# EAGLE design RadioInterfaceMain (EAGLE 6.6.0)
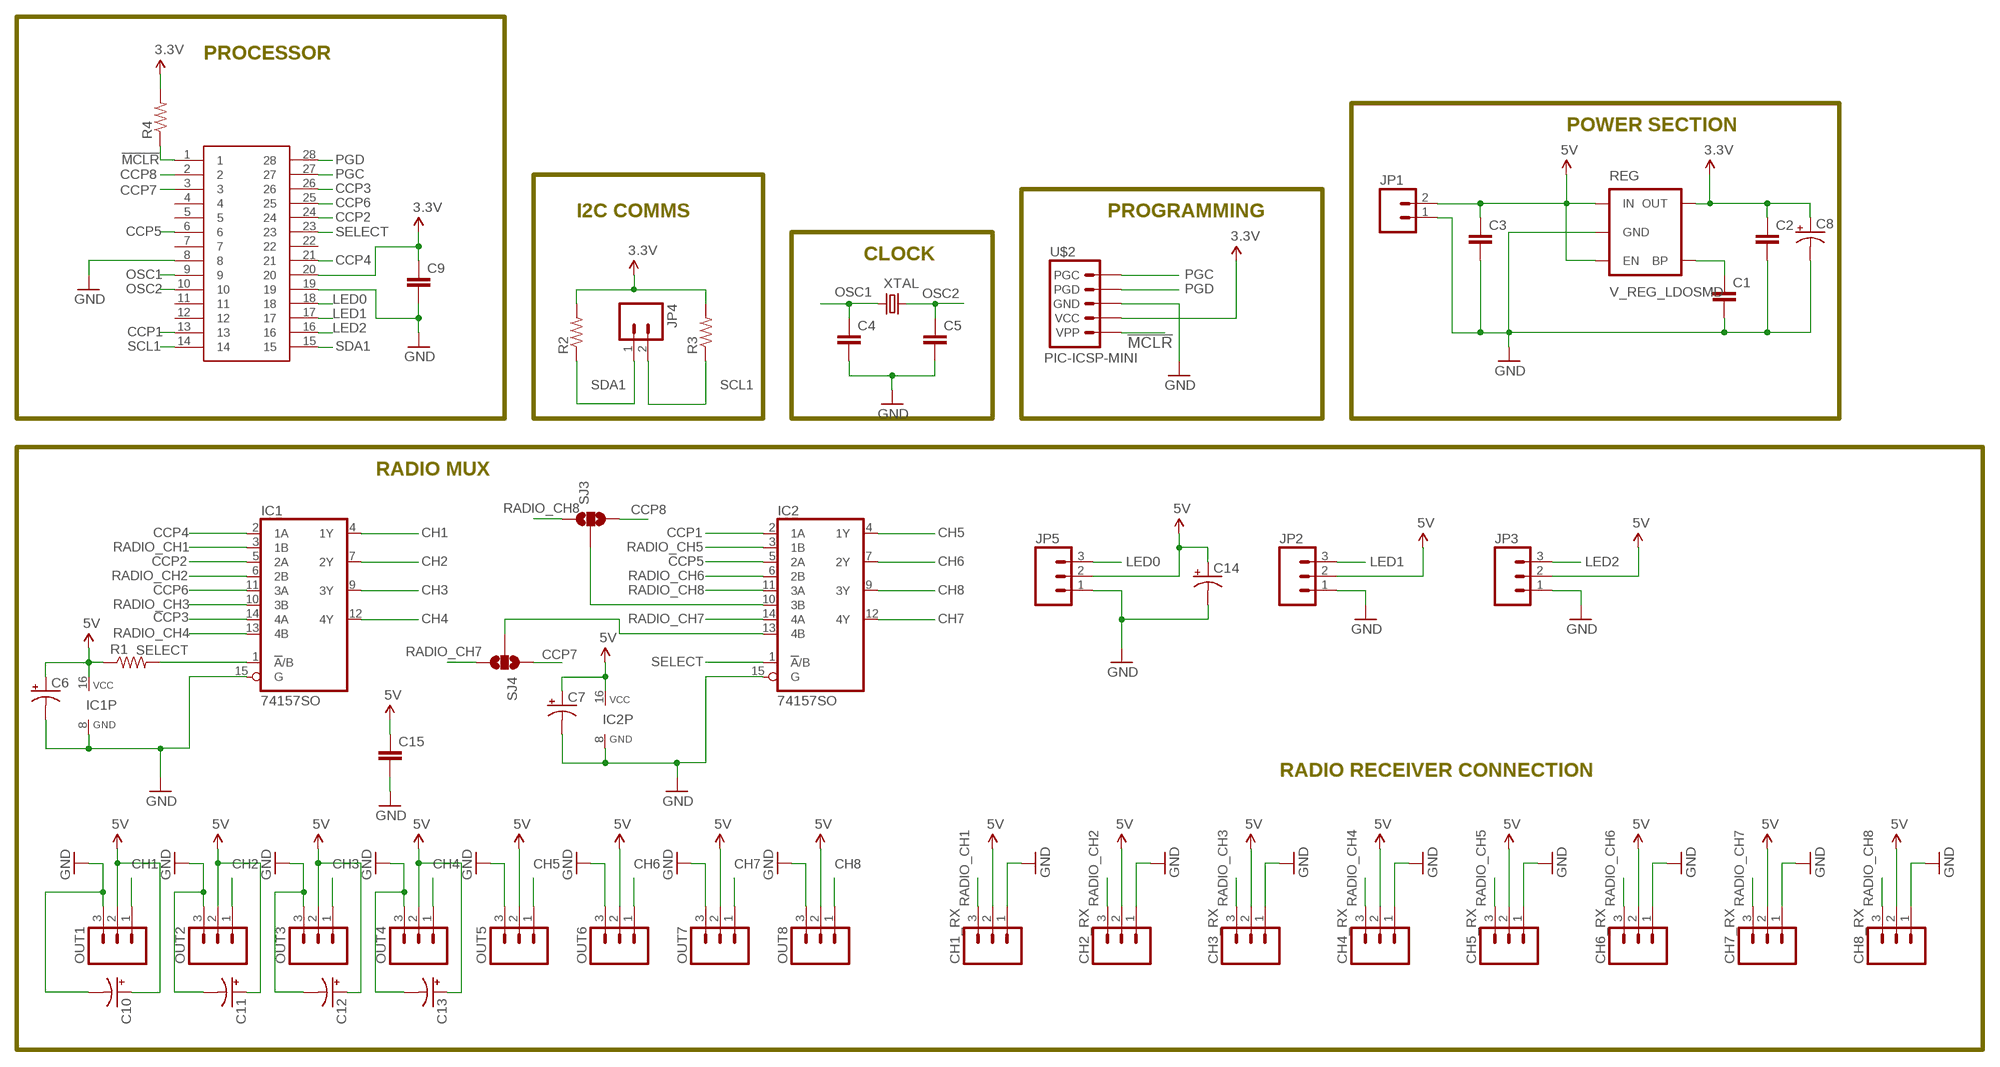
[diagram p0: schematic, sheet 1]

## Parts
C1  CAP0603-CAP  [0603-CAP]
C2  CAP1210  [1210]
C3  CAP1210  [1210]
C4  CAP0603-CAP  [0603-CAP]
C5  CAP0603-CAP  [0603-CAP]
C6  CAP_POL1206  [EIA3216]
C7  CAP_POL1206  [EIA3216]
C8  CAP_POL1206  [EIA3216]
C9  CAP0603-CAP  [0603-CAP]
C10  CAP_POL1206  [EIA3216]
C11  CAP_POL1206  [EIA3216]
C12  CAP_POL1206  [EIA3216]
C13  CAP_POL1206  [EIA3216]
C14  CAP_POL1206  [EIA3216]
C15  CAP0603-CAP  [0603-CAP]
CH1_RX  M03PTH  [1X03]
CH2_RX  M03PTH  [1X03]
CH3_RX  M03PTH  [1X03]
CH4_RX  M03PTH  [1X03]
CH5_RX  M03PTH  [1X03]
CH6_RX  M03PTH  [1X03]
CH7_RX  M03PTH  [1X03]
CH8_RX  M03PTH  [1X03]
IC1  74157SO  [SO016]
IC2  74157SO  [SO016]
JP1  M02-JST-2MM-SMT  [JST-2-SMD]
JP2  M03JST-PTH  [JST-3-PTH]
JP3  M03JST-PTH  [JST-3-PTH]
JP4  M02-JST-2MM-SMT  [JST-2-SMD]
JP5  M03JST-PTH  [JST-3-PTH]
OUT1  M03PTH  [1X03]
OUT2  M03PTH  [1X03]
OUT3  M03PTH  [1X03]
OUT4  M03PTH  [1X03]
OUT5  M03PTH  [1X03]
OUT6  M03PTH  [1X03]
OUT7  M03PTH  [1X03]
OUT8  M03PTH  [1X03]
PIC18F26K22  SSOP28  [SSOP28DB]
R1  RESISTOR0603-RES  [0603-RES]
R2  RESISTOR0603-RES  [0603-RES]
R3  RESISTOR0603-RES  [0603-RES]
R4  RESISTOR0603-RES  [0603-RES]
REG  V_REG_LDOSMD  [SOT23-5]
SJ3  SOLDERJUMPER_2WAY-OLDS  [SJ_3]
SJ4  SOLDERJUMPER_2WAY-OLDS  [SJ_3]
U$2  PIC-ICSP-MINI  [PIC-ICSP-MINI]
XTAL  CRYSTAL5X3  [CRYSTAL-SMD-5X3]

## Nets
3.3V: C2.1 C8.A(+) C9.1 PIC18F26K22.20 R2.2 R3.2 R4.2 REG.5(OUT) U$2.2(VCC)
5V: C3.1 C6.A(+) C7.A(+) C10.A(+) C11.A(+) C12.A(+) C13.A(+) C14.A(+) C15.1 CH1_RX.2 CH2_RX.2 CH3_RX.2 CH4_RX.2 CH5_RX.2 CH6_RX.2 CH7_RX.2 CH8_RX.2 IC1.16(VCC) IC2.16(VCC) JP1.2 JP2.2 JP3.2 JP5.2 OUT1.2 OUT2.2 OUT3.2 OUT4.2 OUT5.2 OUT6.2 OUT7.2 OUT8.2 R1.1 REG.1(IN) REG.3(EN)
!MCLR: PIC18F26K22.1 R4.1 U$2.1(VPP)
CCP1: IC2.2(1A) PIC18F26K22.13
CCP2: IC1.5(2A) PIC18F26K22.24
CCP3: IC1.14(4A) PIC18F26K22.26
CCP4: IC1.2(1A) PIC18F26K22.21
CCP5: IC2.5(2A) PIC18F26K22.6
CCP6: IC1.11(3A) PIC18F26K22.25
CCP7: PIC18F26K22.3 SJ4.1
CCP8: PIC18F26K22.2 SJ3.3
CH1: IC1.4(1Y) OUT1.1
CH2: IC1.7(2Y) OUT2.1
CH3: IC1.9(3Y) OUT3.1
CH4: IC1.12(4Y) OUT4.1
CH5: IC2.4(1Y) OUT5.1
CH6: IC2.7(2Y) OUT6.1
CH7: IC2.12(4Y) OUT7.1
CH8: IC2.9(3Y) OUT8.1
GND: C1.2 C2.2 C3.2 C4.2 C5.2 C6.C(-) C7.C(-) C8.C(-) C9.2 C10.C(-) C11.C(-) C12.C(-) C13.C(-) C14.C(-) C15.2 CH1_RX.1 CH2_RX.1 CH3_RX.1 CH4_RX.1 CH5_RX.1 CH6_RX.1 CH7_RX.1 CH8_RX.1 IC1.8(GND) IC1.15(G) IC2.8(GND) IC2.15(G) JP1.1 JP2.1 JP3.1 JP5.1 OUT1.3 OUT2.3 OUT3.3 OUT4.3 OUT5.3 OUT6.3 OUT7.3 OUT8.3 PIC18F26K22.8 PIC18F26K22.19 REG.2(GND) U$2.3(GND)
LED0: JP5.3 PIC18F26K22.18
LED1: JP2.3 PIC18F26K22.17
LED2: JP3.3 PIC18F26K22.16
N$1: IC2.10(3B) SJ3.2
N$2: C1.1 REG.4(BP)
N$3: IC2.13(4B) SJ4.2
OSC1: C4.1 PIC18F26K22.9 XTAL.1
OSC2: C5.1 PIC18F26K22.10 XTAL.3
PGC: PIC18F26K22.27 U$2.5(PGC)
PGD: PIC18F26K22.28 U$2.4(PGD)
RADIO_CH1: CH1_RX.3 IC1.3(1B)
RADIO_CH2: CH2_RX.3 IC1.6(2B)
RADIO_CH3: CH3_RX.3 IC1.10(3B)
RADIO_CH4: CH4_RX.3 IC1.13(4B)
RADIO_CH5: CH5_RX.3 IC2.3(1B)
RADIO_CH6: CH6_RX.3 IC2.6(2B)
RADIO_CH7: CH7_RX.3 IC2.14(4A) SJ4.3
RADIO_CH8: CH8_RX.3 IC2.11(3A) SJ3.1
SCL1: JP4.2 PIC18F26K22.14 R3.1
SDA1: JP4.1 PIC18F26K22.15 R2.1
SELECT: IC1.1(!A!/B) IC2.1(!A!/B) PIC18F26K22.23 R1.2
Unconnected: PIC18F26K22.4 PIC18F26K22.5 PIC18F26K22.7 PIC18F26K22.11 PIC18F26K22.12 PIC18F26K22.22

## Notes on the sheet
- PROCESSOR
- POWER SECTION
- I2C COMMS | PROGRAMMING
- CLOCK
- RADIO MUX
- RADIO RECEIVER CONNECTION

## Library data of the parts
C1-C5 C9 C15 = SparkFun:CAP: Capacitor Standard 0603 ceramic capacitor, and 0.1" leaded capacitor.
C6-C8 C10-C14 = SparkFun:CAP_POL: Capacitor Polarized These are standard SMD and PTH capacitors. Normally 10uF, 47uF, and 100uF in electrolytic and tantalum varieties. Always verify the external diameter of the through hole cap, it varies with capacity, voltage, and manufacturer. The EIA devices should be standard.
CH1_RX CH2_RX CH3_RX CH4_RX CH5_RX CH6_RX CH7_RX CH8_RX JP2 JP3 JP5 OUT1-OUT8 = SparkFun:M03: Header 3 Standard 3-pin 0.1" header. Use with straight break away headers (SKU : PRT-00116), right angle break away headers (PRT-00553), swiss pins (PRT-00743), machine pins (PRT-00117), and female headers (PRT-00115). Molex polarized connector foot print use with SKU : PRT-08232 with associated crimp pins and housings.
IC1 IC2 = SparkFun:74*157: Quadruple 2-line to 1-line data SELECTOR/MULTIPLEXER
JP1 JP4 = SparkFun:M02: Header 2 Standard 2-pin 0.1" header. Use with straight break away headers (SKU : PRT-00116), right angle break away headers (PRT-00553), swiss pins (PRT-00743), machine pins (PRT-00117), and female headers (PRT-00115). Molex polarized connector foot print use with SKU : PRT-08233 with associated crimp pins and housings.
PIC18F26K22 = SparkFun:SSOP28
R1-R4 = SparkFun:RESISTOR: Resistor Basic schematic elements and footprints for 0603, 1206, and PTH resistors.
REG = SparkFun:V_REG_LDO: Voltage Regulator LDO Standard 150mA LDO voltage regulator in SOT-23 layout. Micrel part MIC5205. BP (by-pass) pin is used to lower output noise with 470pF cap.
SJ3 SJ4 = SparkFun:SOLDERJUMPER_2WAY-OLD: Solder Jumper 2 way solder jumper
U$2 = SparkFun:PIC-ICSP-MINI: PIC-ICSP-Mini Miniature 5-pin connection for temporary programming of PICs. Use this device in your design to save space. Program the PIC with this adapter Spark Fun Electronics SKU : BOB-00194
XTAL = SparkFun:CRYSTAL: Crystals Various standard crystals. Proven footprints. Spark Fun Electronics SKU : COM-00534

## Board
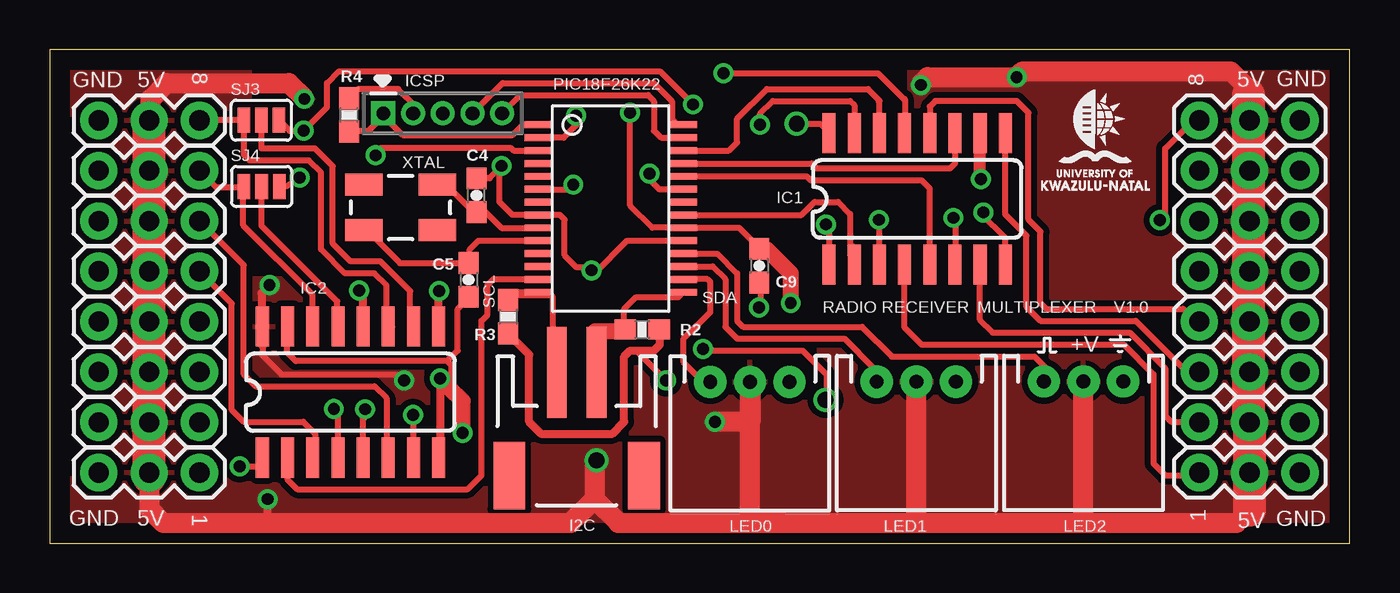
[diagram p1: board, top side]
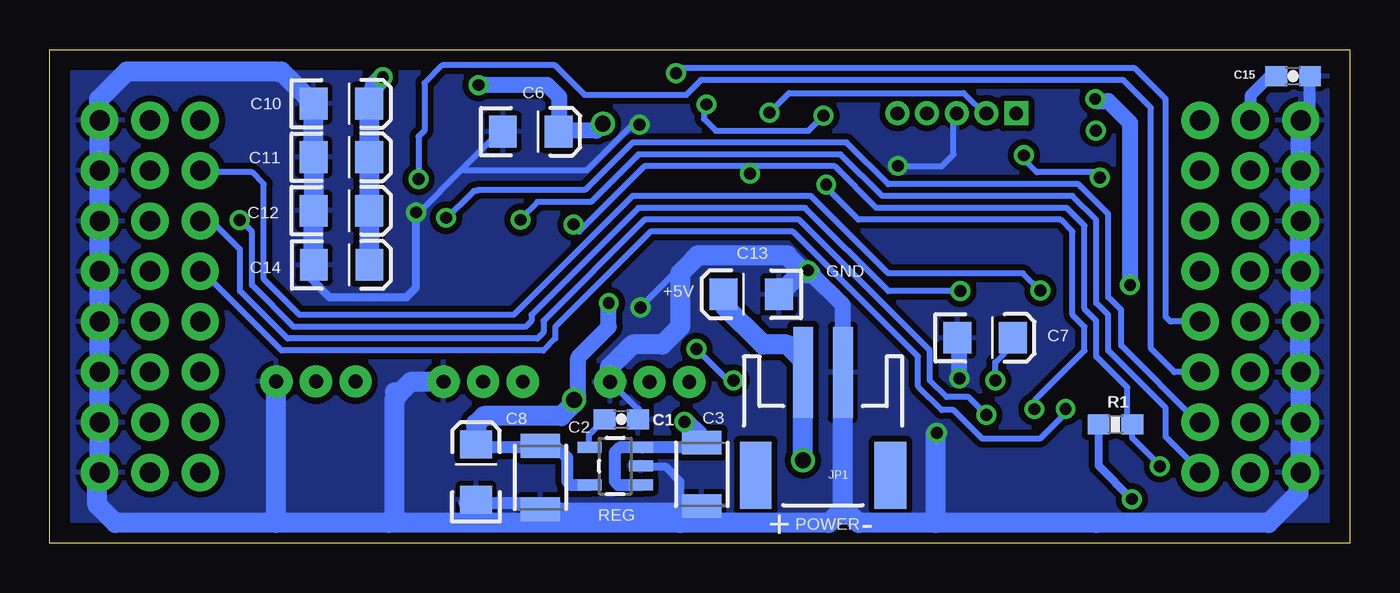
[diagram p2: board, bottom side, seen from below]

Size 65.61 x 24.93 mm. Coordinates in mm from the lower left corner, seen from the top.
Outline: 0,0 65.61,0 65.61,24.93 0,24.93 0,0
Copper layers (1*16): Top 0.035mm / dielectric 1.5mm / Bottom 0.035mm
Design rules "default": minimum track width 10mil, minimum drill 24mil, track to track 8mil, track to pad 8mil, pad to pad 8mil, via to via 8mil, smd to smd 8mil, copper to edge 40mil, drill to drill 8mil, minimum pad ring 10mil, minimum via ring 8mil, stop-mask expansion 4mil, vias tented up to drill 0mil, thermal gap 10mil

### Footprints (pad centres in the part's own frame; a part is rotated, then mirrored left to right if it is on the bottom)
0603-CAP = smd 1.1 x 1: 1 -0.85,0; 2 0.85,0
1210 = smd 1.2 x 2: 1 -1.6,0; 2 1.6,0
EIA3216 = smd 1.4 x 1.6: A 1.4,0; C -1.4,0
1X03 = drill 1.016 pad 1.88 round: 1 0,0; 2 2.54,0; 3 5.08,0
SO016 = smd 0.66 x 2.032: 1 -4.445,-3.315; 2 -3.175,-3.315; 3 -1.905,-3.315; 4 -0.635,-3.315; 5 0.635,-3.315; 6 1.905,-3.315; 7 3.175,-3.315; 8 4.445,-3.315; 9 4.445,3.315; 10 3.175,3.315; 11 1.905,3.315; 12 0.635,3.315; 13 -0.635,3.315; 14 -1.905,3.315; 15 -3.175,3.315; 16 -4.445,3.315
JST-2-SMD = smd 1 x 4.6: 1 -1,-3.7; 2 1,-3.7 | smd 1.6 x 3.4: NC1 -3.4,1.5; NC2 3.4,1.5
JST-3-PTH = drill 0.7 pad 1.626 round: 1 -2,-5; 2 0,-5; 3 2,-5
SSOP28DB = smd 0.348 x 1.397: 1 -4.225,-3.656; 2 -3.575,-3.656; 3 -2.925,-3.656; 4 -2.275,-3.656; 5 -1.625,-3.656; 6 -0.975,-3.656; 7 -0.325,-3.656; 8 0.325,-3.656; 9 0.975,-3.656; 10 1.625,-3.656; 11 2.275,-3.656; 12 2.925,-3.656; 13 3.575,-3.656; 14 4.225,-3.656; 15 4.225,3.656; 16 3.575,3.656; 17 2.925,3.656; 18 2.275,3.656; 19 1.625,3.656; 20 0.975,3.656; 21 0.325,3.656; 22 -0.325,3.656; 23 -0.975,3.656; 24 -1.625,3.656; 25 -2.275,3.656; 26 -2.925,3.656; 27 -3.575,3.656; 28 -4.225,3.656
0603-RES = smd 1.1 x 1: 1 -0.85,0; 2 0.85,0
SOT23-5 = smd 0.55 x 1.2: 1 -0.95,-1.3; 2 0,-1.3; 3 0.95,-1.3; 4 0.95,1.3; 5 -0.95,1.3
SJ_3 = smd 0.635 x 1.27: 1 -0.889,0; 2 0,0; 3 0.889,0
PIC-ICSP-MINI = drill 0.7 square: 1 -3,0 | drill 0.7 round: 2 -1.5,0; 3 0,0; 4 1.5,0; 5 3,0
CRYSTAL-SMD-5X3 = smd 1.9 x 1.1: 1 -1.85,-1.15; 2 1.85,-1.15; 3 1.85,1.15; 4 -1.85,1.15

### Placement (x,y rotation side)
C1  36.77,6.26 0 bottom
C2  40.84,3.33 270 bottom
C3  32.7,3.48 270 bottom
C4  21.54,17.57 90 top
C5  21.14,13.3 270 top
C6  41.34,20.78 0 bottom
C7  18.41,10.38 0 bottom
C8  44.09,3.6 90 bottom
C9  35.8,14.02 270 top
C10  50.88,22.2 0 bottom
C11  50.88,19.5 0 bottom
C12  50.88,16.8 0 bottom
C13  30.21,12.58 180 bottom
C14  50.88,14.06 0 bottom
C15  2.87,23.59 0 bottom
CH1_RX  2.48,3.58 0 top
CH2_RX  2.48,6.12 0 top
CH3_RX  2.48,8.66 0 top
CH4_RX  2.48,11.2 0 top
CH5_RX  2.48,13.74 0 top
CH6_RX  2.48,16.28 0 top
CH7_RX  2.48,18.82 0 top
CH8_RX  2.48,21.36 0 top
IC1  43.77,17.39 0 top
IC2  15.18,7.64 0 top
JP1  26.58,4.93 180 bottom
JP2  43.73,3.17 180 top
JP3  35.34,3.15 180 top
JP4  26.59,4.93 180 top
JP5  52.17,3.17 180 top
OUT1  58,3.58 0 top
OUT2  58,6.12 0 top
OUT3  58,8.66 0 top
OUT4  58,11.2 0 top
OUT5  58,13.74 0 top
OUT6  58,16.28 0 top
OUT7  58,18.82 0 top
OUT8  58,21.36 0 top
PIC18F26K22  28.32,16.91 270 top
R1  11.83,6.01 0 bottom
R2  29.9,10.8 0 top
R3  23.14,11.44 270 top
R4  15.11,21.63 90 top
REG  37.06,3.91 90 bottom
SJ3  10.69,21.37 0 top
SJ4  10.7,18.02 180 top
U$2  19.84,21.71 0 top
XTAL  17.72,16.96 180 top

### Tracks (layer width: path | path; a pad name or v marks a point on that pad's centre or on a via)
3.3V  (via drill 0.6, 0.8)
  Top 0.305: 18.5,21.73 18.5,21.71 U$2.2 18.37,21.73 18.5,21.73 | R4.2 15.57,22.94 17.6,22.94 18.5,22.04 18.5,21.73 | v29.3,21.73 29.3,17.06 30.42,15.94 31.89,15.94 31.92,15.91 31.93,15.93 PIC18F26K22.20 34.8,15.93 35.89,14.84 35.86,14.87 C9.1 35.77,14.84 | v32.97,9.81 33.05,9.74 37.99,9.74 39.2,8.54 39.2,7.29 v39.14,7.24 | v31.1,8.24 29.6,9.74 29.3,9.74
  Top 0.406: R2.2 30.8,10.75 30.8,10.04 30.5,9.74 29.3,9.74 29,9.44 29,6.13 28.39,5.54 24.8,5.54 24.2,6.13 24.2,9.54 R3.2
  Top 0.813: v37.39,12.14 37.39,13.64 36.2,14.84 35.89,14.84 35.84,14.84 C9.1
  Bottom 0.305: U$2.2 18.34,21.58 19.5,22.73 28.3,22.73 v29.3,21.73 | v32.97,9.81 31.39,8.24 v31.1,8.24
  Bottom 0.61: C8.A 44.59,4.9 44.59,4.88 41.48,4.88 C2.1 40.98,4.92 40.99,4.93 40.09,4.93 39.49,4.33 39.49,3.13 39.31,2.96 REG.5 | 39.09,7.24 v39.14,7.24 38.95,7.43
  Bottom 0.813: 38.95,7.43 38.95,9.39 37.39,10.94 v37.39,12.14
  Bottom 1.016: C8.A 44.09,6.04 43.7,6.43 39.79,6.43 39.14,7.08 v39.14,7.24
5V  (via drill 0.6, 0.8)
  Top 0.305: IC1.16 39.33,20.72 39.34,20.73 38.89,21.19 v37.7,21.19 | 10.74,9.99 10.74,9.49 11.71,8.52 17.69,8.52 17.69,8.44 v17.89,8.24
  Top 0.406: 10.74,9.99 IC2.16 10.69,10.45 10.69,12.64 11.14,13.09 v11.09,13.03 | 10.99,1.03 v10.99,2.23
  Top 0.61: 5.09,21.39 5.05,21.39 CH8_RX.2
  Top 1.016: CH1_RX.2 5.03,3.25 5.04,3.23 5.04,1.73 5.75,1.03 10.99,1.03 26.3,1.03 27.5,2.23 | 5.09,21.39 5.09,22.44 5.9,23.23 12.07,23.23 v12.86,22.44 v12.85,22.44 | v27.6,4.2 27.57,4.23 27.52,4.23 27.52,2.26 27.5,2.23 | 60.54,1.69 59.89,1.03 52.09,1.03 | 35.29,1.03 28.7,1.03 27.5,2.23 | 37.09,1.03 43.99,1.03 | 43.99,1.03 52.09,1.03 | 35.34,1.07 JP3.2 | 35.29,1.03 35.34,1.07 | JP2.2 43.73,1.29 43.99,1.03 | 52.09,1.03 52.09,1.33 52.17,1.41 JP5.2 | v43.97,23.14 43.97,23.21 44.29,23.54 v48.79,23.54 49.09,23.84 59.59,23.84 60.54,22.89 | 35.34,1.07 35.38,1.03 37.09,1.03 | 35.29,1.03 37.09,1.03 | 35.29,1.03 35.34,1.08 35.34,8.12 35.37,8.09 35.37,6.18 35.32,6.13 v33.57,6.13
  Top 1.676: 5.07,18.82 5.15,18.73 | 5.07,18.82 CH7_RX.2 CH6_RX.2 | CH8_RX.2 5.03,18.86 5.07,18.82 | CH6_RX.2 5.03,16.26 5.04,16.23 | CH5_RX.2 5.03,13.56 5.04,13.54 | CH5_RX.2 CH6_RX.2 | 5,11.2 4.95,11.14 | 5,11.2 CH4_RX.2 5.03,8.82 4.95,8.74 CH3_RX.2 CH2_RX.2 | CH5_RX.2 5.03,11.22 5,11.2 | CH2_RX.2 5.03,6.01 4.95,5.93 | CH2_RX.2 CH1_RX.2 5.03,3.35 5.04,3.33 | 60.54,1.69 60.54,6.08 60.49,6.13 60.49,22.64
  Bottom 0.305: v37.7,21.19 38.1,20.78 | C7.A 17.01,10.05 17,10.04 17.89,9.14 v17.89,8.24 | JP1.2 27.5,8.54 | JP1.2 | 27.8,9.44 27.8,8.84 JP1.2
  Bottom 0.406: 12.82,22.46 v12.85,22.44 | R1.1 12.68,3.92 v10.99,2.23
  Bottom 0.61: C3.1 32.54,5.08 32.45,4.99 32.57,4.85 REG.3 35.71,4.85 35.7,4.83 36.84,4.83 37.09,4.58 37.09,3.13 36.91,2.96 REG.1 | C15.1 4.04,23.59 5,22.64 5,21.44 5.03,21.41 CH8_RX.2
  Bottom 0.813: 39.88,20.83 C6.A | 39.88,20.83 39.88,22.53 40.49,23.14 v43.97,23.14 | v37.7,21.19 37.7,21.16 38.03,20.83 39.88,20.83 | v11.09,13.03 11.09,21.23 12.19,22.34 12.79,22.34 12.85,22.39 v12.85,22.44
  Bottom 1.016: C13.A 31.61,12.05 29.6,10.04 28.39,10.04 27.8,9.44 27.6,9.24 v27.6,4.2 | v48.79,23.54 49.18,23.14 C10.A 49.48,19.73 49.39,19.64 49.48,19.55 C11.A C12.A | C12.A 49.48,16.73 49.39,16.64 | 49.48,14.02 49.39,13.94 | 49.48,14.02 C14.A | C12.A 49.48,14.03 49.48,14.02 | C3.1 32.79,5.17 32.83,5.17 32.83,5.4 v33.57,6.13
  pour Top (isolate 0.305): -0.1,24.44 -0.1,0.43 64.7,0.43 64.7,24.44 43.39,24.44 43.39,13.34 10.09,13.34 10.09,24.44
!MCLR
  Top 0.305: U$2.1 16.84,21.28 | 16.7,21.44 16.82,21.55 U$2.1 | R4.1 15.17,20.84 16.09,20.84 16.7,21.44 | U$2.1 16.81,21.73 16.7,21.73 16.7,21.44 | PIC18F26K22.1 23.89,21.13 23.37,20.61 17.82,20.61 16.84,21.59 U$2.1
CCP1
  Top 0.305: 11.99,3.83 12.01,3.82 IC2.2 12.01,4.3 11.99,4.29 11.99,3.23 12.49,2.73 21.1,2.73 21.8,3.44 21.8,11.24 22.1,11.54 22.1,13.04 22.39,13.34 24.5,13.34 24.5,13.33 PIC18F26K22.13
CCP2
  Top 0.305: 44.39,14.44 44.39,15.04 | 44.39,14.44 IC1.5 | 44.39,14.44 44.39,17.94 43.99,18.34 38.39,18.34 38.2,18.53 PIC18F26K22.24
CCP3
  Top 0.305: 41.89,20.54 41.99,20.64 41.92,20.71 IC1.14 41.87,20.76 41.89,20.79 41.84,20.84 41.84,22.29 41.89,22.34 41.29,22.94 36.2,22.94 34.7,21.44 34.7,20.23 34.29,19.83 PIC18F26K22.26
CCP4
  Top 0.305: IC1.2 40.49,14.19 40.49,15.04 | IC1.2 40.6,14.18 40.49,14.29 | PIC18F26K22.21 37.94,16.58 38.59,17.23 39.79,17.23 40.39,16.64 40.39,14.54 40.7,14.24 40.6,14.14 IC1.2
CCP5  (via drill 0.6)
  Top 0.305: 15.82,3.71 15.74,3.63 15.79,3.58 | IC2.5 15.82,3.71 | 16.02,6.48 16.08,6.53 | 16.02,6.48 v15.92,6.78 | 15.82,3.71 15.82,6.28 16.02,6.48 | PIC18F26K22.6 24.7,17.84 26.3,17.84 | 26.3,17.84 26.43,17.96 v26.43,18.12 | 26.3,17.84 26.6,17.84
  Bottom 0.305: v15.92,6.78 15.92,6.56 15.89,6.54 15.89,7.24 13.39,9.74 13.39,10.94 13.99,11.54 13.99,15.74 14.59,16.34 24.8,16.34 26.3,17.84 26.25,17.88 v26.43,18.12
CCP6
  Top 0.305: 45.77,20.71 45.79,20.73 | 45.77,20.71 IC1.11 45.68,20.5 45.7,20.48 45.7,19.19 45.45,18.94 38.7,18.94 38.45,19.18 PIC18F26K22.25 | 45.77,20.71 45.7,20.64
CCP7  (via drill 0.6)
  Top 0.305: SJ4.1 11.91,18.02 v12.62,18.47 | 16.39,19.64 16.44,19.59 v16.46,19.59 16.73,19.86 16.73,19.98 23.25,19.98 23.4,19.83 PIC18F26K22.3
  Bottom 0.305: v12.62,18.47 12.34,18.47 12.6,18.73 15.79,18.73 16.7,19.64 16.5,19.64 v16.46,19.59
CCP8  (via drill 0.6)
  Top 0.305: SJ3.3 12.11,20.84 v12.81,20.84 v12.82,20.84 13.99,22.02 13.99,23.23 14.59,23.84 30.8,23.84 32.59,22.04 v32.47,22.16 | v26.55,21.6 26.55,21.18 26.6,21.14 25.94,20.48 PIC18F26K22.2
  Bottom 0.305: v26.55,21.6 27.32,20.84 32,20.84 32.59,21.44 32.59,22.04 v32.47,22.16
CH1
  Top 0.305: IC1.4 43.14,10.89 43.99,10.04 54.2,10.04 55.7,8.54 55.7,4.04 56.29,3.44 58.09,3.44 58,3.52 OUT1.1
CH2
  Top 0.305: 57.89,6.04 57.99,6.13 OUT2.1 58.07,6.12 58.09,6.13 56.59,6.13 56.29,6.43 56.29,8.84 54.49,10.64 47.59,10.64 46.95,11.28 IC1.7
CH3
  Top 0.305: IC1.9 48.22,16.61 49.29,15.54 49.29,11.94 49.99,11.24 54.79,11.24 57.49,8.54 57.79,8.54 57.91,8.66 OUT3.1 | OUT3.1 58.09,8.74 | OUT3.1 | OUT3.1
CH4
  Top 0.305: IC1.12 44.41,22.05 44.69,22.33 48.8,22.33 49.39,21.73 49.39,16.34 49.99,15.74 49.99,12.14 50.29,11.84 57.2,11.84 57.84,11.2 OUT4.1 | 57.89,11.24 57.93,11.2 OUT4.1 | 57.99,11.14 58,11.15 OUT4.1
CH5  (via drill 0.6)
  Top 0.305: IC2.4 14.55,6.48 v14.34,6.79
  Bottom 0.305: v14.34,6.79 14.44,6.49 15.64,5.29 18.55,5.29 20,6.74 20.6,6.74 21.8,7.93 21.8,9.44 28.1,15.74 35.29,15.74 40.09,10.94 40.09,10.34 40.7,9.74 53.89,9.74 57.89,13.74 OUT5.1
CH6  (via drill 0.6)
  Top 0.305: v18.35,6.49 18.35,6.54 18.36,6.52 IC2.7
  Bottom 0.305: 58,16.3 58.04,16.34 | 58,16.3 OUT6.1 57.85,16.28 57.79,16.34 57.49,16.34 55.99,14.84 55.99,12.74 53.59,10.34 40.99,10.34 40.7,10.64 40.7,11.24 35.59,16.34 27.8,16.34 21.2,9.74 21.2,8.24 20.35,7.38 19.25,7.38 v18.35,6.49 18.3,6.43 | 58,16.3 OUT6.1
CH7  (via drill 0.6)
  Top 0.305: v15.62,12.76 15.84,12.64 15.82,12.61
  Top 0.406: IC2.12 15.82,11.36 15.79,11.39 15.82,11.41 15.82,12.61
  Bottom 0.305: 15.79,12.64 v15.62,12.76 16.5,13.64 23.3,13.64 27.2,17.54 36.2,17.54 42.2,11.54 52.99,11.54 54.79,13.34 54.79,18.14 55.39,18.73 58.09,18.73 OUT7.1 | 58,18.86 58.03,18.88 | OUT7.1 58,18.86 | 58,18.86 57.98,18.83 | 57.99,18.84 OUT7.1
CH8  (via drill 0.6)
  Top 0.305: 19.63,12.72 v19.64,12.74 | OUT8.1 58.04,21.36 58.05,21.34 57.7,21.34 56.29,19.94 56.29,16.64 55.99,16.34 56,16.33 v56.02,16.33
  Top 0.406: IC2.9 19.6,10.99 19.63,11.02 19.63,12.72
  Bottom 0.305: 19.6,12.74 v19.64,12.74 23.3,12.74 27.5,16.94 35.89,16.94 41.29,11.54 41.29,11.24 41.59,10.94 53.29,10.94 55.39,13.04 55.39,15.74 55.99,16.34 56,16.33 v56.02,16.33
GND  (via drill 0.6)
  Top 0.305: 48.24,14.06 IC1.8 48.22,14.21 48.2,14.24 48.2,15.44 46.99,16.64 47.07,16.71 v47.12,16.71 | 21.5,18.44 21.51,18.43 C4.2 21.53,18.44 21.5,18.44 | 21.5,18.44 22.1,18.44 | 21.5,18.44 22.21,18.44 v22.81,19.06 22.72,19.06 22.7,19.04 22.7,17.23 23.35,16.58 PIC18F26K22.8 25.75,16.58 26,16.34 26,14.54 26.6,13.94 27.2,13.94 | 11.99,10.39 11.99,9.64 12.42,9.21 20.07,9.21 | C5.2 21.16,12.44 21.2,12.44 20.6,11.84 20.6,9.74 20.07,9.21 | 20.19,7.83 20.3,7.93 20.3,8.98 20.07,9.21 | 27.2,13.94 27.15,13.98 | 27.2,13.94 v27.35,13.79 27.5,13.64 29.14,15.28 PIC18F26K22.19 | v35.8,11.91 35.87,11.84 35.89,11.84 35.89,13.08 C9.2 | v35.84,21.14 35.84,21.69 36.49,22.34 40.39,22.34 40.6,22.13 IC1.15
  Top 0.406: 11.99,10.39 IC2.15 | 19.7,4.26 19.7,4.04 | 19.7,4.26 IC2.8 | v19.7,8.33 19.7,4.26
  Top 0.61: IC2.8 19.64,3.79
  Top 0.813: v19.7,8.33 20.19,7.83 20.84,7.19 v20.84,5.58 v20.84,5.59
  Bottom 0.305: C6.C 42.9,20.78 44.77,18.91 | v47.12,16.71 47.04,16.64 44.77,18.91 | C8.C 44.66,2.2 44.59,2.13 44.64,2.08 | 44.77,18.91 44.7,18.84 38.49,18.84 36.2,21.14 v35.84,21.14 | U$2.3 20,21.55 20,19.64 20.6,19.04 23,19.04 23,19.05 v22.81,19.06 | 37.34,8.18 37.39,8.24 | JP3.1 37.34,8.18 | 37.34,8.18 35.91,6.75 | 33.04,14.39 33.2,14.54 35.8,11.93 v35.8,11.91 | REG.2 35.75,3.9 34.56,3.9 33.82,3.16 33.82,1.08 33.79,1.05 33.79,1.03
  Bottom 0.406: C3.2 33.09,1.88 | REG.2 35.74,3.93 35.7,3.88 34.54,3.88 33.79,3.13 33.79,1.73 33.79,1.64 | 12.79,1.03 12.68,1.15 | JP3.1 37.31,8.16 | 35.91,6.75 C1.2 | v47.12,16.71 47.12,12.91 47.59,12.44 51.49,12.44 52.39,13.34 52.39,13.94 C14.C
  Bottom 0.61: C8.C 44.7,2.04 41.75,2.04 C2.2 41.43,1.73 33.79,1.73 32.79,1.73 32.79,1.79 C3.2 | 2.48,21.25 2.6,21.14 | CH8_RX.1 2.48,21.25 | C15.2 2.02,21.71 2.48,21.25
  Bottom 0.813: C7.C 19.7,10.27 v19.7,8.33 | v20.84,5.59 v20.84,5.58 | 20.89,1.23 20.84,1.29 | JP1.1 25.59,12.03 27.2,13.64
  Bottom 1.016: 25.59,1.82 JP1.1 | 20.89,1.03 12.79,1.03 4.09,1.03 2.6,2.54 2.6,3.73 | 2.6,3.73 2.48,3.62 CH1_RX.1 | 20.84,1.29 20.89,1.34 | 20.89,1.03 20.89,1.23 20.89,5.45 20.84,5.5 20.88,5.54 20.89,5.54 v20.84,5.59 | C13.C 27.75,13.64 27.5,13.64 | 27.5,13.64 27.2,13.64 v27.35,13.79 27.5,13.64 | 20.89,1.03 24.8,1.03 25.59,1.82 | 25.59,1.82 25.59,1.74 26.3,1.03 33.79,1.03 48.49,1.03 | 48.49,1.03 54.2,1.03 | 54.2,1.03 62.29,1.03 63.2,1.94 63.2,3.46 OUT1.3 63.09,5.95 62.91,6.12 | JP2.1 47.36,8.17 48.04,7.49 | 48.04,7.49 48.2,7.33 48.2,1.33 48.49,1.03 | JP5.1 54.17,1.06 54.2,1.03 | 48.04,7.49 48.2,7.63 | JP3.1 37.34,8.9 36.2,10.04 34.7,10.04 33.79,10.94 33.79,13.64 33.04,14.39 32.89,14.54 28.39,14.54 27.5,13.64 | 62.91,6.12 62.89,6.13 | 62.91,6.12 OUT2.3 63.09,8.43 63.2,8.54 OUT3.3 63.09,11.12 63.15,11.2 | 63.15,11.2 63.2,11.24 | 63.15,11.2 OUT4.3 63.09,13.53 63.2,13.64 OUT5.3 63.09,16.23 63.13,16.28 | 63.13,16.28 63.2,16.34 | 63.13,16.28 OUT6.3 63.09,18.62 63.2,18.73 63.11,18.82 OUT7.3 63.09,20.82 | OUT8.3 63.09,21.25 63.2,21.14 63.09,21.03 63.09,20.82 | 63.09,20.82 63.11,20.82 63.11,22.42 61.7,23.84 54.2,23.84 54.17,23.81 53.9,23.81 C10.C 52.31,22.17 52.31,19.67 52.29,19.65 C11.C | C14.C 52.31,14.09 52.31,16.77 C12.C C11.C | C11.C | CH2_RX.1 2.48,6.13 | 2.6,3.73 2.48,3.85 CH2_RX.1 | CH3_RX.1 2.48,8.67 | CH3_RX.1 2.5,8.67 2.5,11.19 CH4_RX.1 CH5_RX.1 | CH2_RX.1 | CH2_RX.1 CH3_RX.1 | CH5_RX.1 2.48,13.75 | CH5_RX.1 2.5,13.75 2.5,16.27 CH6_RX.1 2.5,16.29 2.5,18.83 | 2.5,18.83 | 2.5,18.83 CH7_RX.1 CH8_RX.1 | CH8_RX.1 2.48,21.4 | CH8_RX.1
  pour Bottom (isolate 0.305): 0.2,24.44 0.2,0.43 65.3,0.43 65.3,24.44
LED0
  Top 0.305: PIC18F26K22.18 33.7,14.63 34.7,13.64 34.7,11.24 34.99,10.94 40.99,10.94 42.49,9.44 49.7,9.44 50.29,8.84 50.29,8.24 50.23,8.17 JP5.3
LED1
  Top 0.305: PIC18F26K22.17 33.45,13.98 34.09,13.34 34.09,10.94 34.7,10.34 40.09,10.34 41.59,8.84 41.59,8.24 41.73,8.1 | 41.73,8.1 41.89,7.93 | 41.73,8.1 JP2.3
LED2
  Top 0.305: 33.34,13.2 33.2,13.34 32,13.34 31.99,13.33 PIC18F26K22.16 | JP3.3 32.97,8.16 32,9.14 32,10.34 33.34,11.68 33.34,13.2 | 33.34,13.2
N$1
  Top 0.305: SJ3.2 10.69,19.94 13.39,19.94 14.29,19.04 14.29,15.14 15.19,14.24 16.7,14.24 18.2,12.74 18.2,11.12 IC2.10
  Top 0.406: IC2.10 18.36,10.42 18.35,10.44 18.39,10.49
N$2
  Bottom 0.305: REG.4 38.38,4.83 38.39,4.83 38.39,5.49 C1.1
N$3
  Top 0.305: SJ4.2 10.7,16.03 14.52,12.21 14.52,10.92 | 14.52,10.92 14.52,10.55 | IC2.13 14.52,10.92
  Top 0.406: 14.54,10.49 14.55,10.48 IC2.13
OSC1
  Top 0.305: C4.1 21.54,16.68 21.5,16.64 21.6,16.54 | C4.1 21.41,16.73 20.3,17.84 20,17.84 19.7,18.14 19.67,18.11 XTAL.1 | C4.1 21.59,16.73 21.8,16.94 22.8,15.93 PIC18F26K22.9
OSC2
  Top 0.305: 16.09,15.74 16.39,15.44 | 16.09,15.74 16.02,15.81 XTAL.3 | C5.1 17.68,14.15 16.09,15.74 | 20.89,14.24 20.98,14.15 C5.1 | PIC18F26K22.10 21.64,15.28 21.2,14.84 21.2,14.24 21.14,14.19 C5.1
PGC
  Top 0.305: U$2.5 23.77,22.64 30.2,22.64 30.5,22.34 30.5,20.84 30.85,20.48 PIC18F26K22.27
PGD
  Top 0.305: 32,21.14 31.99,21.13 PIC18F26K22.28 31.96,21.12 31.71,21.12 31.39,21.44 31.39,22.34 30.5,23.23 22.87,23.23 U$2.4
RADIO_CH1  (via drill 0.6)
  Top 0.305: IC1.3 41.84,14.11 v41.84,16.34
  Bottom 0.305: CH1_RX.3 7.54,3.59 7.54,3.63 9.29,5.38 9.29,6.83 12.19,9.74 12.19,11.54 12.79,12.14 12.79,16.34 13.99,17.54 23.6,17.54 25.7,19.64 35.89,19.64 38.29,17.23 40.99,17.23 41.89,16.34 | 41.89,16.34 41.95,16.29 | 41.89,16.34 v41.84,16.34
RADIO_CH2  (via drill 0.6)
  Top 0.305: IC1.6 45.7,16.44 v45.59,16.44
  Bottom 0.305: CH2_RX.3 7.54,6.13 | CH2_RX.3 7.59,6.08 | CH2_RX.3 7.67,6.12 11.54,9.99 11.54,11.79 12.19,12.44 12.19,16.64 13.69,18.14 23.3,18.14 25.39,20.23 36.2,20.23 38.59,17.84 43.99,17.84 44.04,17.79 44.2,17.79 45.7,16.29 v45.59,16.44
RADIO_CH3  (via drill 0.6)
  Top 0.61: 46.99,18.24 47,18.24 | v46.99,18.39 46.99,18.24 | IC1.10 46.95,18.29 46.99,18.24
  Bottom 0.305: CH3_RX.3 8.84,8.66 | 8.84,8.66 8.86,8.66 | v46.99,18.39 47.04,18.34 | v46.99,18.39 46.95,18.44 | 8.84,8.66 8.84,8.64 10.04,9.84 10.04,21.98 11.44,23.39 32.74,23.39 33.49,22.64 38.59,22.64 40.09,24.14 45.79,24.14 46.7,23.23 46.7,20.84 46.99,20.54 v46.99,18.39 | 46.99,18.29 47.05,18.24 | v46.99,18.39 46.99,18.29 | 46.99,18.29 46.95,18.34
RADIO_CH4  (via drill 0.6)
  Top 0.305: IC1.13 43.14,20.73 43.2,20.79 43.14,20.84 43.14,22.44 43.1,22.44 41.8,23.73 v34,23.73
  Bottom 0.305: CH4_RX.3 9.05,11.2 9.29,11.44 9.29,22.44 10.84,23.98 33.95,23.98 34.09,23.84 34,23.74 v34,23.73
RADIO_CH5
  Top 0.305: 13.29,3.99 13.24,3.93 13.28,3.9 IC2.3 13.39,4.44 13.39,5.54 12.79,6.13 9.79,6.13 9.19,6.74 9.19,12.11 CH5_RX.3
RADIO_CH6
  Top 0.305: 17.05,4.13 17.14,4.04 17.09,3.98 IC2.6 17,4.33 17,7.33 16.39,7.93 10.39,7.93 9.79,8.54 9.79,14.05 CH6_RX.3
RADIO_CH7
  Top 0.305: CH7_RX.3 8.42,17.96 9.78,17.96 9.78,16.05 13.27,12.56 13.27,10.95 | 13.27,10.95 13.27,10.86 | IC2.14 13.27,10.95
  Top 0.406: 13.29,11.24 13.29,10.99 13.19,10.89 13.19,10.49 13.2,10.49 IC2.14 | 9.78,17.96 9.78,17.98 SJ4.3
  Top 0.61: 7.54,18.84 CH7_RX.3 7.57,18.96 7.54,18.98
RADIO_CH8
  Top 0.305: CH8_RX.3 SJ3.1 9.81,19.62 10.09,19.34 13.09,19.34 13.69,18.73 13.69,14.84 14.89,13.64 16.39,13.64 17,13.04 17,11.24 | 17.28,10.96 17.3,10.94 | 17.28,10.96 IC2.11 17,11.05 17,11.24 | 17.28,10.96 17,11.24
  Top 0.406: 17.1,10.44 17.09,10.43 IC2.11 | SJ3.1 9.83,21.34
SCL1
  Top 0.305: PIC18F26K22.14 23.61,12.69 | 23.61,12.69 23.23,12.69 23,12.45 23,12.31 R3.1 | JP4.2 25.39,9.08 25.39,12.44 25.32,12.51 23.61,12.51 23.61,12.69
SDA1
  Top 0.305: PIC18F26K22.15 31.73,12.44 29.6,12.44 29,11.84 29,10.74 | 29,10.74 29,10.64 | R2.1 29,10.74
  Top 0.406: JP4.1 27.54,8.84 27.5,8.84 27.55,10.71
  Top 0.813: R2.1 28.94,10.71 27.55,10.71
SELECT  (via drill 0.6)
  Top 0.305: IC2.1 10.78,3.77 10.79,3.79 10.69,3.88 v9.59,3.88 | IC1.1 39.33,15.95 v39.17,16.11 | PIC18F26K22.23 30.75,17.88 30.2,18.44 30.27,18.51 v30.27,18.66
  Bottom 0.305: 9.51,3.9 v9.59,3.88 9.54,3.88 10.98,5.32 R1.2 11.04,5.95 11.22,5.95 11.22,7.86 12.79,9.44 12.79,11.24 13.39,11.84 13.39,16.04 14.29,16.94 23.89,16.94 26,19.04 30.2,19.04 | v30.27,18.66 30.2,18.73 30.2,19.04 | v39.17,16.11 39.17,16.01 38.89,15.74 35.59,19.04 30.2,19.04

### Text on the board
tPlace: GND | 5V | 8 | 5V | GND | ICSP | 8 | C:/Users/Yashren/Pictures/logo2rgbmono4.bmp | SCL | SDA | RADIO RECEIVER | MULTIPLEXER | V1.0 | +V | GND | 5V | 1 | 5V | GND | I2C | LED0 | LED1 | LED2 | 1
bPlace: GND | +5V | POWER | - | +